# Altium project PICO核心板.PrjPcb
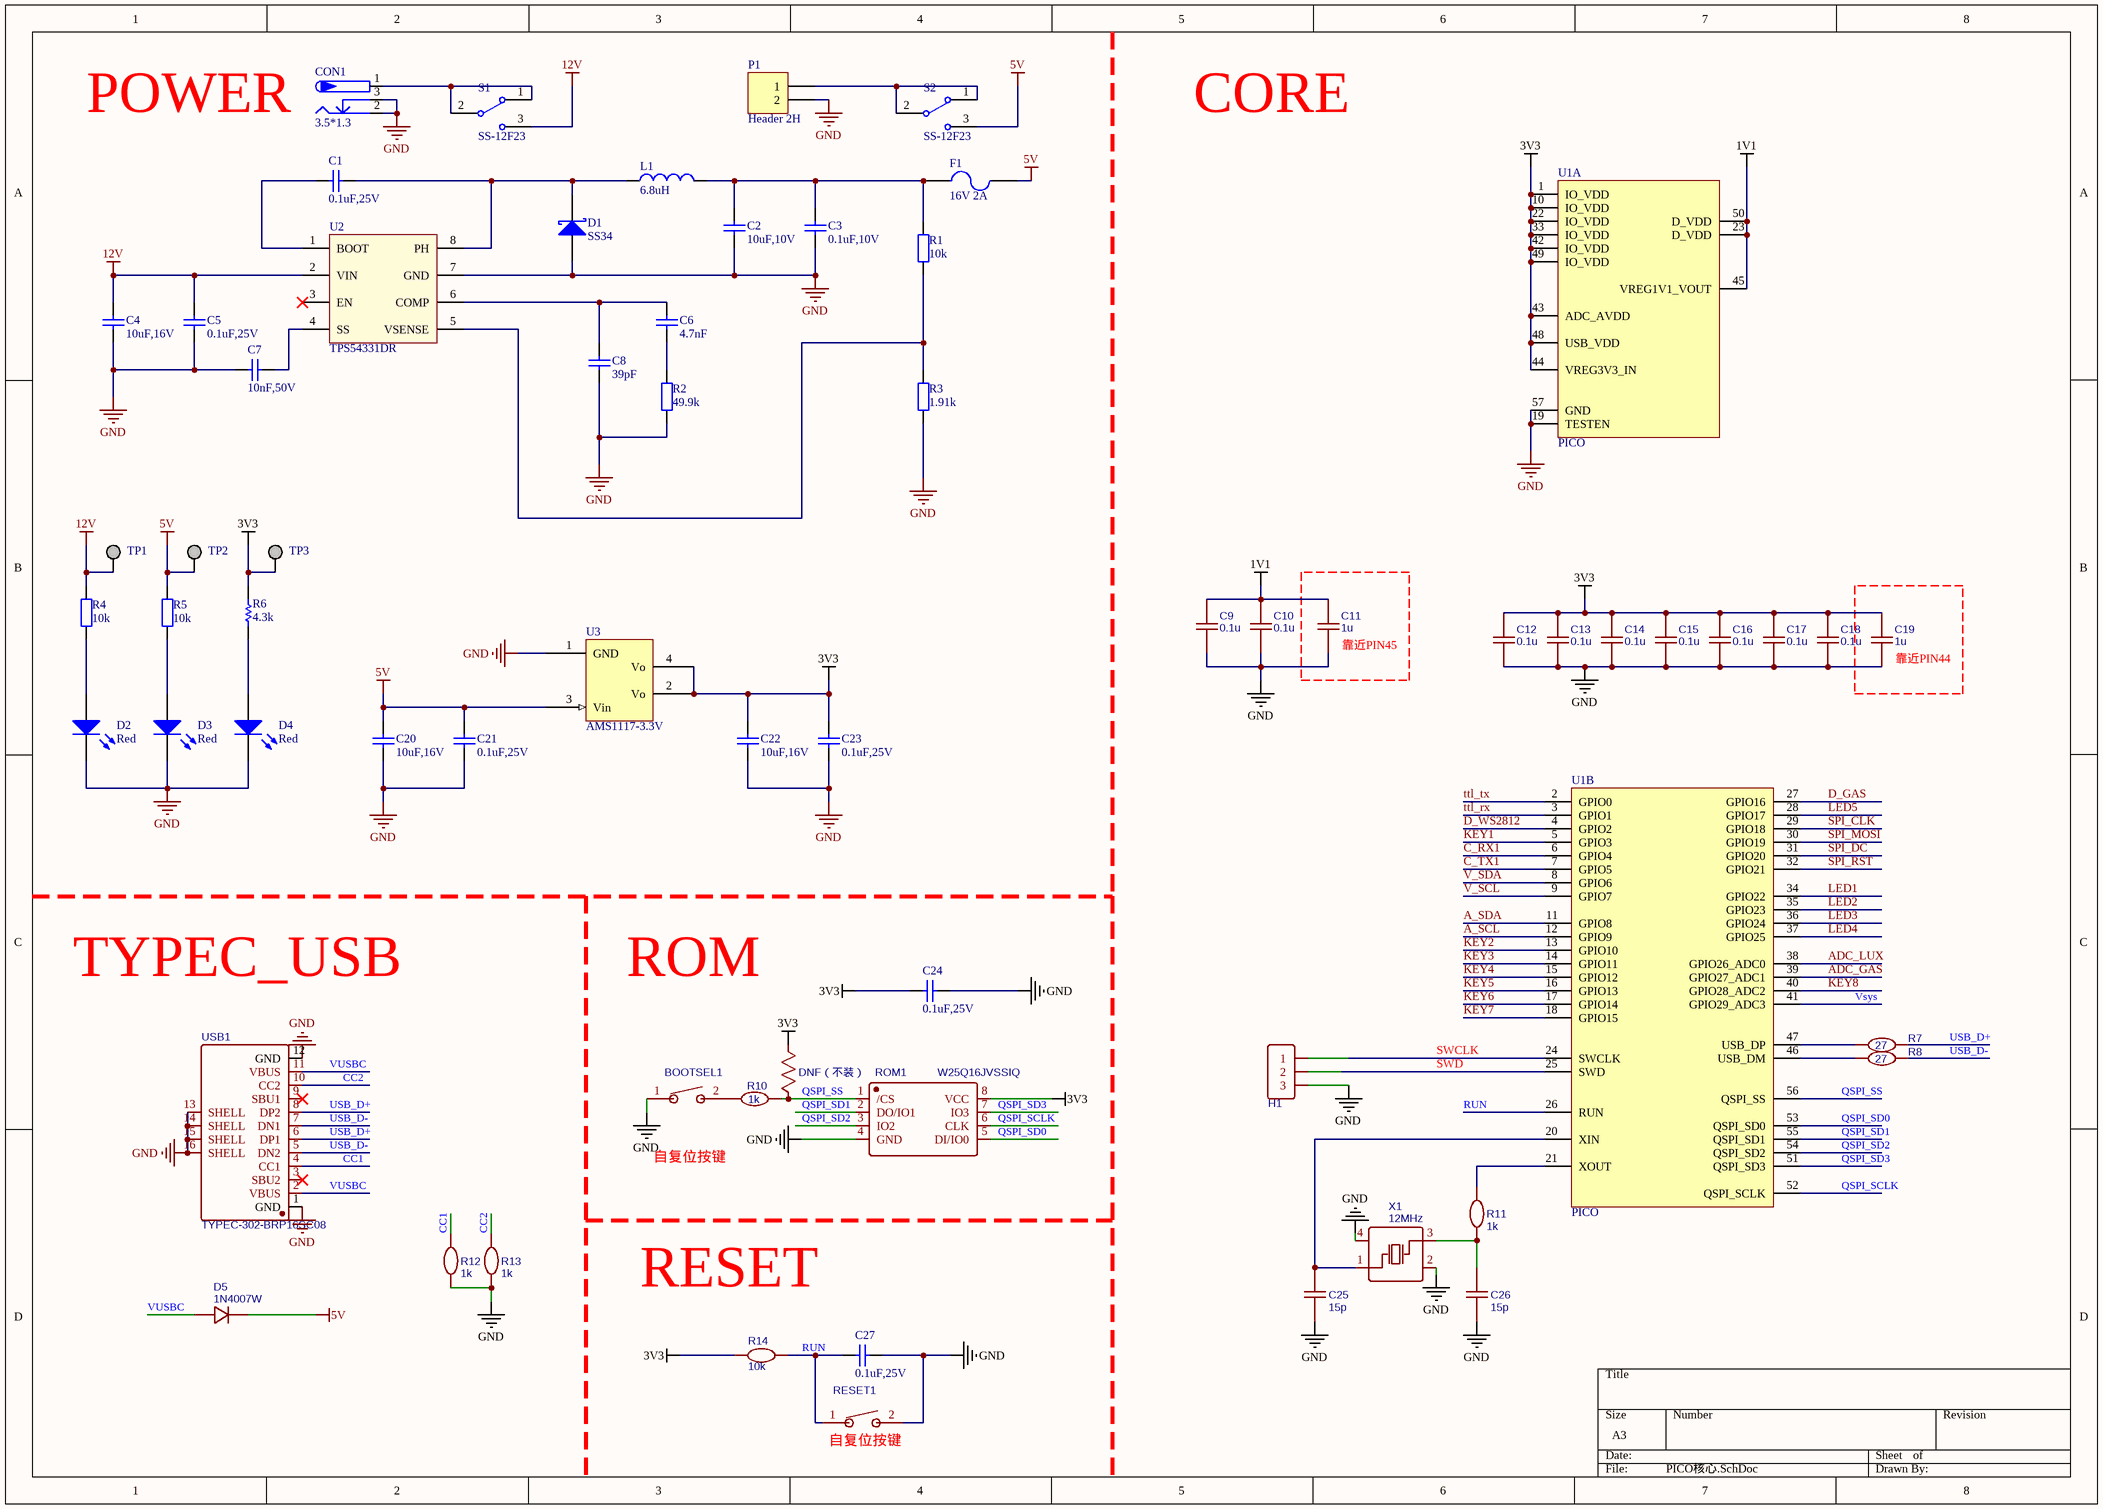
[diagram p0: PICO核心.SchDoc]
5 sheets, 147 parts. Net scope: global (net labels, ports and power ports of the same name join across sheets).
Board file: PICO核心.PcbDoc
Sheets:
  PICO核心.SchDoc
  传感器.SchDoc
  车门车灯子系统.SchDoc
  环境监测系统.SchDoc
  语音识别系统.SchDoc

## Sheet PICO核心.SchDoc
size A3

### Parts
BOOTSEL1  TSA343G00-250J2  [SW-SMD_4P-L6.2-W6.3-P4.00-LS9.4]  (value not drawn)
C1  value 0.1uF,25V  [0402_C]  (hidden comment: Cap)
C2  value 10uF,10V  [0402_C]  (hidden comment: Cap)
C3  value 0.1uF,10V  [1206_C]  (hidden comment: Cap)
C4  value 10uF,16V  [0402_C]  (hidden comment: Cap)
C5  value 0.1uF,25V  [0402_C]  (hidden comment: Cap)
C6  4.7nF  [0402_C]
C7  value 10nF,50V  [0402_C]  (hidden comment: Cap)
C8  39pF  [0402_C]
C9  0.1u  [0402_C]
C10  0.1u  [0402_C]
C11  1u  [0402_C]
C12  0.1u  [0402_C]
C13  0.1u  [0402_C]
C14  0.1u  [0402_C]
C15  0.1u  [0402_C]
C16  0.1u  [0402_C]
C17  0.1u  [0402_C]
C18  0.1u  [0402_C]
C19  1u  [0402_C]
C20  value 10uF,16V  [0402_C]  (hidden comment: Cap)
C21  value 0.1uF,25V  [0402_C]  (hidden comment: Cap)
C22  value 10uF,16V  [0402_C]  (hidden comment: Cap)
C23  value 0.1uF,25V  [0402_C]  (hidden comment: Cap)
C24  value 0.1uF,25V  [0402_C]  (hidden comment: Cap)
C25  15p  [0402_C]
C26  15p  [0402_C]
C27  value 0.1uF,25V  [0402_C]  (hidden comment: Cap)
CON1  3.5*1.3  [DC-IN-TH_DC-005-5A-2.5]
D1  value SS34  [SMA_L4.3-W2.6-LS5.2-RD]  (hidden comment: Diode Schottky)
D2  value Red  [0603_LED]  (hidden comment: LED)
D3  value Red  [0603_LED]  (hidden comment: LED)
D4  value Red  [0603_LED]  (hidden comment: LED)
D5  1N4007W  [SMA_L4.3-W2.6-LS5.2-RD]
F1  16V 2A  [1206_FUSE]
H1  HDR-F-2.54_1x3  [XH2.54A-3]  (value not drawn)
L1  6.8uH  [IND-SMD_L5.8-W5.2]
P1  Header 2H  [XH2.54A-2]
R1  value 10k  [0402_R]  (hidden comment: Res)
R2  49.9k  [0402_R]
R3  1.91k  [0402_R]
R4  value 10k  [0402_R]  (hidden comment: Res)
R5  value 10k  [0402_R]  (hidden comment: Res)
R6  value 4.3k  [0402_R]  (hidden comment: Res_5%)
R7  27  [0402_R]
R8  27  [0402_R]
R9  DNF（不装）  [0402_R]
R10  1k  [0402_R]
R11  1k  [0402_R]
R12  1k  [0402_R]
R13  1k  [0402_R]
R14  10k  [0402_R]
RESET1  TSA343G00-250J2  [SW-SMD_4P-L6.2-W6.3-P4.00-LS9.4]  (value not drawn)
ROM1  W25Q16JVSSIQ  [SOIC8-208mil]
S1  SS-12F23  [SW-TH_MT-0-103-A101-M200-RS]
S2  SS-12F23  [SW-TH_MT-0-103-A101-M200-RS]
TP1  TP  [TP_H]  (value not drawn)  (no BOM)
TP2  TP  [TP_H]  (value not drawn)  (no BOM)
TP3  TP  [TP_H]  (value not drawn)  (no BOM)
U1  PICO  [LQFN-56_L7.0-W7.0-P0.4-EP]  (parts A,B of 2)
U2  TPS54331DR  [SOIC8E]
U3  value AMS1117-3.3V  [SOT223]  (hidden comment: AMS1117)
USB1  TYPEC-302-BRP16SC08  [USB-C-SMD_TYPEC-302-BRP16SC08]
X1  12MHz  [OSC 3225-4P]

### Blocks framed on the sheet
靠近PIN45: C11
靠近PIN44: C19

### Nets
1V1: C9.1 C10.1 C11.2 U1.23(D_VDD) U1.45(VREG1V1_VOUT) U1.50(D_VDD)
3V3: C12.1 C13.2 C14.2 C15.2 C16.2 C17.2 C18.2 C19.2 C22.2 C23.2 C24.2 R6.2 R9.2 R14.2 ROM1.8(VCC) TP3.1 U1.1(IO_VDD) U1.10(IO_VDD) U1.22(IO_VDD) U1.33(IO_VDD) U1.42(IO_VDD) U1.43(ADC_AVDD) U1.44(VREG3V3_IN) U1.48(USB_VDD) U1.49(IO_VDD) U3.2(Vo) U3.4(Vo)
5V: C20.2 C21.2 D5.1 F1.2 R5.2 S2.3 TP2.1 U3.3(Vin)
12V: C4.2 C5.2 R4.2 S1.3 TP1.1 U2.2(VIN)
GND: BOOTSEL1.1 C2.1 C3.1 C4.1 C5.1 C7.2 C8.1 C9.2 C10.2 C11.1 C12.2 C13.1 C14.1 C15.1 C16.1 C17.1 C18.1 C19.1 C20.1 C21.1 C22.1 C23.1 C24.1 C25.1 C26.1 C27.2 CON1.2 CON1.3 D1.1(A) D2.2(K) D3.2(K) D4.2(K) H1.3 P1.2 R2.1 R3.1 R12.1 R13.1 RESET1.2 ROM1.4(GND) U1.19(TESTEN) U1.57(GND) U2.7(GND) U3.1(GND) USB1.1(GND) USB1.12(GND) USB1.13(SHELL) USB1.14(SHELL) USB1.15(SHELL) USB1.16(SHELL) X1.2(GND) X1.4(GND)
A_SCL: U1.12(GPIO9)
A_SDA: U1.11(GPIO8)
ADC_GAS: U1.39(GPIO27_ADC1)
ADC_LUX: U1.38(GPIO26_ADC0)
C_RX1: U1.6(GPIO4)
C_TX1: U1.7(GPIO5)
CC1: R12.2 USB1.4(CC1)
CC2: R13.2 USB1.10(CC2)
D_GAS: U1.27(GPIO16)
D_WS2812: U1.4(GPIO2)
KEY1: U1.5(GPIO3)
KEY2: U1.13(GPIO10)
KEY3: U1.14(GPIO11)
KEY4: U1.15(GPIO12)
KEY5: U1.16(GPIO13)
KEY6: U1.17(GPIO14)
KEY7: U1.18(GPIO15)
KEY8: U1.40(GPIO28_ADC2)
LED1: U1.34(GPIO22)
LED2: U1.35(GPIO23)
LED3: U1.36(GPIO24)
LED4: U1.37(GPIO25)
LED5: U1.28(GPIO17)
QSPI_SCLK: ROM1.6(CLK) U1.52(QSPI_SCLK)
QSPI_SD0: ROM1.5(DI/IO0) U1.53(QSPI_SD0)
QSPI_SD1: ROM1.2(DO/IO1) U1.55(QSPI_SD1)
QSPI_SD2: ROM1.3(IO2) U1.54(QSPI_SD2)
QSPI_SD3: ROM1.7(IO3) U1.51(QSPI_SD3)
QSPI_SS: R9.1 R10.2 ROM1.1(/CS) U1.56(QSPI_SS)
RUN: C27.1 R14.1 RESET1.1 U1.26(RUN)
SPI_CLK: U1.29(GPIO18)
SPI_DC: U1.31(GPIO20)
SPI_MOSI: U1.30(GPIO19)
SPI_RST: U1.32(GPIO21)
ttl_rx: U1.3(GPIO1)
ttl_tx: U1.2(GPIO0)
USB_D+: R7.2 USB1.6(DP1) USB1.8(DP2)
USB_D-: R8.2 USB1.5(DN2) USB1.7(DN1)
V_SCL: U1.9(GPIO7)
V_SDA: U1.8(GPIO6)
Vsys: U1.41(GPIO29_ADC3)
VUSBC: D5.2 USB1.2(VBUS) USB1.11(VBUS)
NetBOOTSEL1_2: BOOTSEL1.2 R10.1
NetC1_1: C1.1 D1.2(K) L1.1 U2.8(PH)
NetC1_2: C1.2 U2.1(BOOT)
NetC2_2: C2.2 C3.2 F1.1 L1.2 R1.2
NetC6_1: C6.1 R2.2
NetC6_2: C6.2 C8.2 U2.6(COMP)
NetC7_1: C7.1 U2.4(SS)
NetC25_2: C25.2 U1.20(XIN) X1.1(OSC1)
NetC26_2: C26.2 R11.1 X1.3(OSC2)
NetCON1_1: CON1.1 S1.1 S1.2
NetD2_1: D2.1(A) R4.1
NetD3_1: D3.1(A) R5.1
NetD4_1: D4.1(A) R6.1
NetH1_1: H1.1 U1.24(SWCLK)
NetH1_2: H1.2 U1.25(SWD)
NetP1_1: P1.1 S2.1 S2.2
NetR1_1: R1.1 R3.2 U2.5(VSENSE)
NetR7_1: R7.1 U1.47(USB_DP)
NetR8_1: R8.1 U1.46(USB_DM)
NetR11_2: R11.2 U1.21(XOUT)

Not connected (* = marked no-connect by the designer): U2 3(EN)*; USB1 3(SBU2)* 9(SBU1)*

### Notes on the sheet
- POWER
- CORE
- TYPEC_USB
- ROM
- SWCLK
- SWD
- 自复位按键
- RESET
- (near RESET1) 自复位按键

### Library data of the parts
BOOTSEL1 RESET1 = TSA343G00-250J2: BOM_Manufacturer: BRIGHT; Contributor: LCSC; BOM_Supplier: LCSC; BOM_Supplier Part: C354946; BOM_Manufacturer Part: TSA343G00-250J2; BOM_JLCPCB Part Class: Extended Part; spicePre: S; spiceSymbolName: TSA343G00-250J2
C1 C5 C21 C23 C24 C27 = T_Cap_0603_0.1uF_25V_X5R: 贴片电容; Part Typer: X5R; Solder: SMD; Withstand Voltage: 25V; Tolerance: 10%; Schematic Path: X:\Database\Schematic Library.Schlib; Part Number: T_Cap_0603_0.1uF_25V_X5R; LibRef: T_Cap_0603_0.1uF_25V_X5R
C2 C3 = T_Cap_1206_47uF_10V_X5R: 贴片电容; Part Typer: X5R; Solder: SMD; Withstand Voltage: 10V; Tolerance: 10%; Schematic Path: X:\Database\Schematic Library.Schlib; Part Number: T_Cap_1206_47uF_10V_X5R; LibRef: T_Cap_1206_47uF_10V_X5R
C4 C20 C22 = T_Cap_0603_10uF_16V_X5R: 贴片电容; Part Typer: X5R; Solder: SMD; Withstand Voltage: 16V; Tolerance: 10%; Schematic Path: X:\Database\Schematic Library.Schlib; Part Number: T_Cap_0603_10uF_16V_X5R; LibRef: T_Cap_0603_10uF_16V_X5R
C6 C8 = Cap
C7 = T_Cap_0603_10nF_50V_X7R: 贴片电容; Part Typer: X7R; Solder: SMD; Withstand Voltage: 50V; Tolerance: 10%; Schematic Path: X:\Database\Schematic Library.Schlib; Part Number: T_Cap_0603_10nF_50V_X7R; LibRef: T_Cap_0603_10nF_50V_X7R
C9-C19 = 0.1u: nameAlias: Value(F); Contributor: LCEDA_Lib; spicePre: C; spiceSymbolName: C_0603_US
C25 = 15p: nameAlias: Value(F); Contributor: LCEDA_Lib; spicePre: C; spiceSymbolName: C_0603_US
C26 = 15p: nameAlias: Value(F); Contributor: LCEDA_Lib; Package Display: No; spicePre: C; spiceSymbolName: C_0603_US
CON1 = P-DC: 低压电源接口; BOM名称: DC电源接口; 版权归属: 源创客; 学习资源: www.ooocke.com
D1 = T_SS34: 肖特基二极管; Part Number: T_SS34; Solder: SMD; Schematic Path: X:\Database\Schematic Library.Schlib; LibRef: T_SS34
D2-D4 = T_LED_Red_0805: 红色LED灯; Solder: SMD; Schematic Path: X:\Database\Schematic Library.Schlib; Part Number: T_LED_Red_0805; LibRef: T_LED_Red_0805
D5 = 1N4007W: BOM_Manufacturer: BLUE ROCKET; Contributor: LCEDA_Lib; BOM_Supplier: LCSC; BOM_Supplier Part: C328592; BOM_Manufacturer Part: 1N4007W; spicePre: D; spiceSymbolName: 1N4007W
F1 = Fuse
H1 = HDR-F-2.54_1x3: Contributor: LCEDA_Lib; BOM_Supplier Part: C146690; BOM_Supplier: LCSC; spicePre: H; spiceSymbolName: HDR-F-2.54_1x3
L1 = Inductor
P1 = Header 2H: Header, 2-Pin, Right Angle; LatestRevisionDate: 17-Jul-2002; LatestRevisionNote: Re-released for DXP Platform.; Publisher: Altium Limited
R1 R4 R5 = T_Res_0603_10k_1%_1/10W: 贴片电阻; Solder: SMD; Power: 1/10W; Tolerance: 1%; Schematic Path: X:\Database\Schematic Library.Schlib; Part Number: T_Res_0603_10k_1%_1/10W; LibRef: T_Res_0603_10k_1%_1/10W
R2 R3 = Res
R6 = T_Res_0603_4.3k_5%_1/10W: 贴片电阻; Solder: SMD; Power: 1/10W; Tolerance: 5%; Schematic Path: X:\Database\Schematic Library.Schlib; Part Number: T_Res_0603_4.3k_5%_1/10W; LibRef: T_Res_0603_4.3k_5%_1/10W
R7 R8 = 27: nameAlias: Value(Ω); Contributor: LCEDA_Lib; spicePre: R; spiceSymbolName: R_0603_EU
R9 = DNF（不装）: nameAlias: Value(Ω); Contributor: LCEDA_Lib; spicePre: R; spiceSymbolName: R_0603_US
R10-R14 = 1k: nameAlias: Value(Ω); Contributor: LCEDA_Lib; spicePre: R; spiceSymbolName: R_0603_EU
ROM1 = W25Q16JVSSIQ: BOM_Manufacturer: WINBOND; BOM_Supplier: LCSC; BOM_Manufacturer Part: W25Q16JVSSIQ; BOM_Supplier Part: C82317; BOM_JLCPCB Part Class: Extended Part; spicePre: U; spiceSymbolName: W25Q16JVSSIQ
S1 S2 = SSW-1P: 1路波动开关; BOM名称: 波动开关; 版权归属: 源创客; 学习资源: www.ooocke.com
TP1-TP3 = T_TestPoint_H: 测试点_过孔; Solder: DIP; Schematic Path: X:\Database\Schematic Library.Schlib; Part Number: T_TestPoint_H; LibRef: T_TestPoint_H
U1 = PICO_CORE
U2 = TPS54331: TI, 3A, 3.5-28V, Buck
U3 = T_AMS1117-3.3V: 电源芯片; Solder: SMD; Schematic Path: X:\Database\Schematic Library.Schlib; Part Number: T_AMS1117-3.3V; LibRef: T_AMS1117-3.3V; ComponentLink2Description: Datasheet; ComponentLink2URL: X:\Database\Datasheet\AMS1117.pdf
USB1 = TYPEC-302-BRP16SC08: BOM_Manufacturer: XUNPU(讯普); Contributor: LCSC; BOM_Supplier: LCSC; BOM_Supplier Part: C2835312; BOM_Manufacturer Part: TYPEC-302-BRP16SC08; spicePre: U; spiceSymbolName: TYPEC-302-BRP16SC08
X1 = 12MHz: BOM_Manufacturer: YXC; BOM_Manufacturer Part: X322512MLB4SI; nameAlias: Frequency; BOM_Supplier: LCSC; BOM_Supplier Part: C112971; BOM_JLCPCB Part Class: Extended Part; spicePre: X; spiceSymbolName: X322512MLB4SI

## Sheet 传感器.SchDoc
size A4
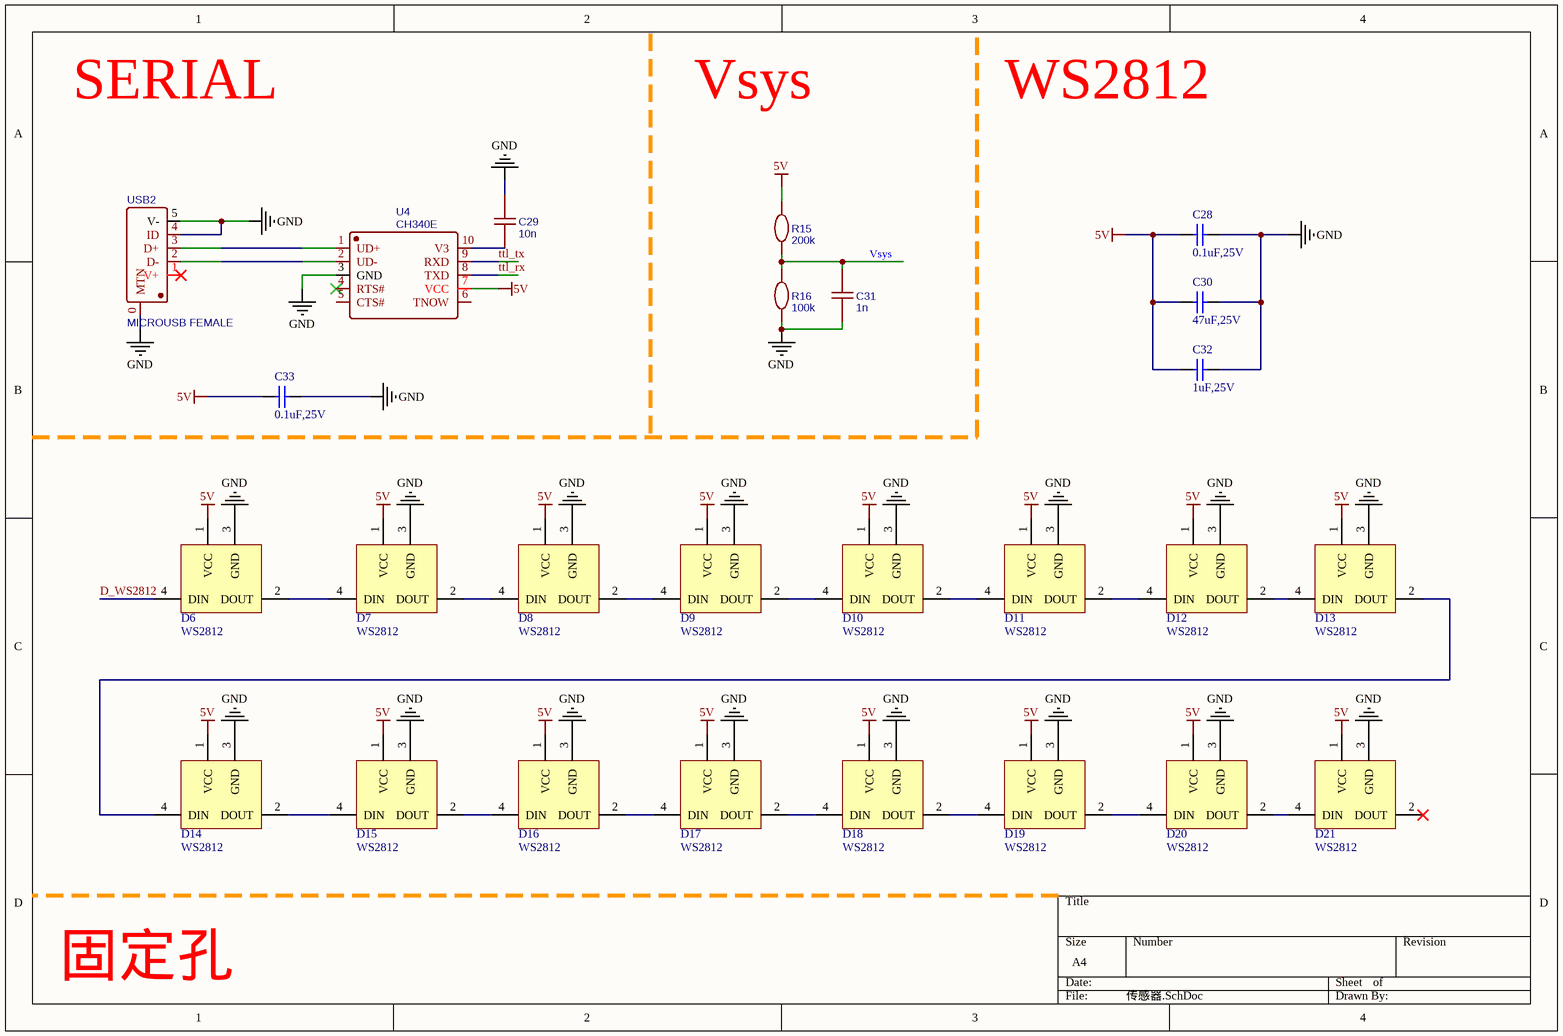
[diagram p1: 传感器.SchDoc]

### Parts
C28  value 0.1uF,25V  [0402_C]  (hidden comment: Cap)
C29  10n  [0402_C]
C30  value 47uF,25V  [0402_C]  (hidden comment: Cap)
C31  1n  [0402_C]
C32  value 1uF,25V  [0402_C]  (hidden comment: Cap)
C33  value 0.1uF,25V  [0402_C]  (hidden comment: Cap)
D6  WS2812  [LED-SMD_4P-L3.5-W3.5-TL_WS2812B]
D7  WS2812  [LED-SMD_4P-L3.5-W3.5-TL_WS2812B]
D8  WS2812  [LED-SMD_4P-L3.5-W3.5-TL_WS2812B]
D9  WS2812  [LED-SMD_4P-L3.5-W3.5-TL_WS2812B]
D10  WS2812  [LED-SMD_4P-L3.5-W3.5-TL_WS2812B]
D11  WS2812  [LED-SMD_4P-L3.5-W3.5-TL_WS2812B]
D12  WS2812  [LED-SMD_4P-L3.5-W3.5-TL_WS2812B]
D13  WS2812  [LED-SMD_4P-L3.5-W3.5-TL_WS2812B]
D14  WS2812  [LED-SMD_4P-L3.5-W3.5-TL_WS2812B]
D15  WS2812  [LED-SMD_4P-L3.5-W3.5-TL_WS2812B]
D16  WS2812  [LED-SMD_4P-L3.5-W3.5-TL_WS2812B]
D17  WS2812  [LED-SMD_4P-L3.5-W3.5-TL_WS2812B]
D18  WS2812  [LED-SMD_4P-L3.5-W3.5-TL_WS2812B]
D19  WS2812  [LED-SMD_4P-L3.5-W3.5-TL_WS2812B]
D20  WS2812  [LED-SMD_4P-L3.5-W3.5-TL_WS2812B]
D21  WS2812  [LED-SMD_4P-L3.5-W3.5-TL_WS2812B]
R15  200k  [0402_R]
R16  100k  [0402_R]
U4  CH340E  [MSOP-10_L3.0-W3.0-P0.50-LS5.0-BL]
USB2  MICROUSB FEMALE  [USB-B/S_A]

### Nets
5V: C28.2 C30.2 C32.2 C33.2 D6.1(VCC) D7.1(VCC) D8.1(VCC) D9.1(VCC) D10.1(VCC) D11.1(VCC) D12.1(VCC) D13.1(VCC) D14.1(VCC) D15.1(VCC) D16.1(VCC) D17.1(VCC) D18.1(VCC) D19.1(VCC) D20.1(VCC) D21.1(VCC) R15.2 U4.7(VCC)
GND: C28.1 C29.2 C30.1 C31.1 C32.1 C33.1 D6.3(GND) D7.3(GND) D8.3(GND) D9.3(GND) D10.3(GND) D11.3(GND) D12.3(GND) D13.3(GND) D14.3(GND) D15.3(GND) D16.3(GND) D17.3(GND) D18.3(GND) D19.3(GND) D20.3(GND) D21.3(GND) R16.1 U4.3(GND) USB2.0(MTN) USB2.4(ID) USB2.5(V-)
D_WS2812: D6.4(DIN)
ttl_rx: U4.8(TXD)
ttl_tx: U4.9(RXD)
Vsys: C31.2 R15.1 R16.2
NetC29_1: C29.1 U4.10(V3)
NetD6_2: D6.2(DOUT) D7.4(DIN)
NetD7_2: D7.2(DOUT) D8.4(DIN)
NetD8_2: D8.2(DOUT) D9.4(DIN)
NetD9_2: D9.2(DOUT) D10.4(DIN)
NetD10_2: D10.2(DOUT) D11.4(DIN)
NetD11_2: D11.2(DOUT) D12.4(DIN)
NetD12_2: D12.2(DOUT) D13.4(DIN)
NetD13_2: D13.2(DOUT) D14.4(DIN)
NetD14_2: D14.2(DOUT) D15.4(DIN)
NetD15_2: D15.2(DOUT) D16.4(DIN)
NetD16_2: D16.2(DOUT) D17.4(DIN)
NetD17_2: D17.2(DOUT) D18.4(DIN)
NetD18_2: D18.2(DOUT) D19.4(DIN)
NetD19_2: D19.2(DOUT) D20.4(DIN)
NetD20_2: D20.2(DOUT) D21.4(DIN)
NetU4_1: U4.1(UD+) USB2.3(D+)
NetU4_2: U4.2(UD-) USB2.2(D-)

Not connected (* = marked no-connect by the designer): D21 2(DOUT)*; U4 4(RTS#)* 5(CTS#) 6(TNOW); USB2 1(V+)*

### Notes on the sheet
- SERIAL
- Vsys
- WS2812
- 固定孔

### Library data of the parts
C28 C30 C32 C33 = T_Cap_0603_0.1uF_25V_X5R: as C1 on sheet PICO核心; Part Number: T_Cap_0603_0.1uF_25V_X5R; LibRef: T_Cap_0603_0.1uF_25V_X5R
C29 = 10n: nameAlias: Value(F); Contributor: LCEDA_Lib; spicePre: C; spiceSymbolName: C_0603_US
C31 = 1n: nameAlias: Value(F); Contributor: LCEDA_Lib; spicePre: C; spiceSymbolName: C_0603_US
R15 = 200k: nameAlias: Value(Ω); Contributor: LCEDA_Lib; spicePre: R; spiceSymbolName: R_0603_EU
R16 = 100k: nameAlias: Value(Ω); Contributor: LCEDA_Lib; spicePre: R; spiceSymbolName: R_0603_EU
U4 = CH340E: BOM_Manufacturer: WCH; BOM_Supplier: LCSC; BOM_Manufacturer Part: CH340E; BOM_Supplier Part: C99652; BOM_JLCPCB Part Class: Extended Part; spicePre: U; spiceSymbolName: CH340E
USB2 = MICROUSB FEMALE: BOM_Manufacturer: ValuePro; BOM_Supplier: LCSC; BOM_Manufacturer Part: micro USBFemale; BOM_Supplier Part: C10418; BOM_JLCPCB Part Class: Extended Part; spicePre: U; spiceSymbolName: MICROUSB FEMALE

## Sheet 车门车灯子系统.SchDoc
size A4
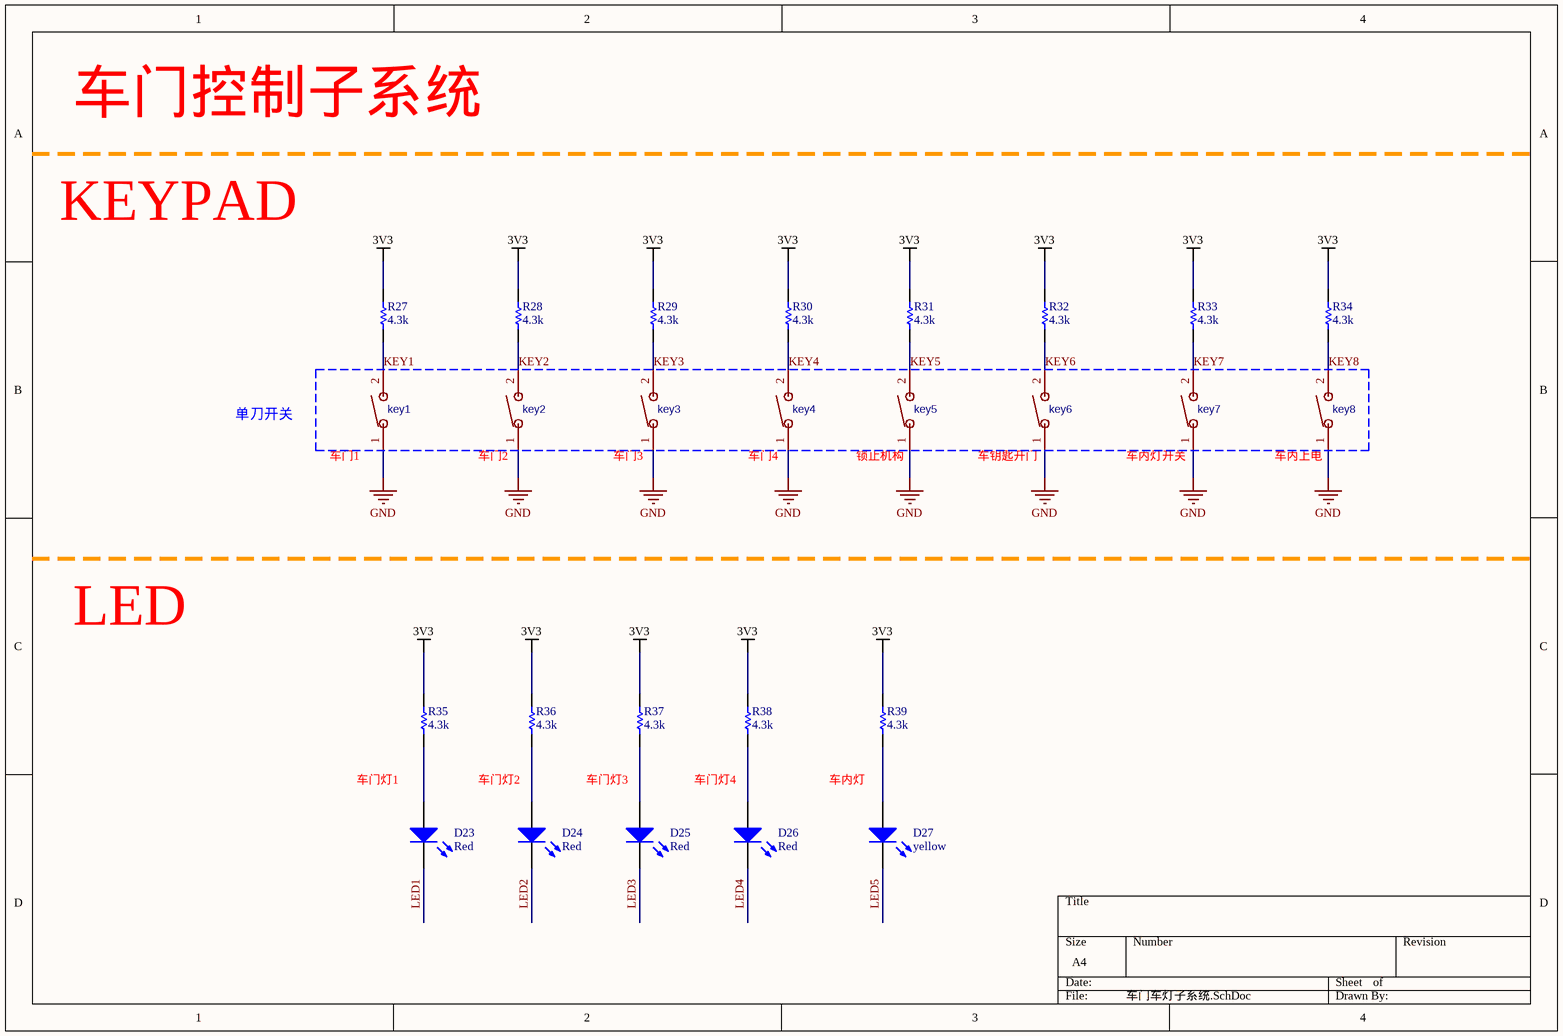
[diagram p2: 车门车灯子系统.SchDoc]

### Parts
D23  value Red  [LED-TH_L5.0-W2.7-FD]  (hidden comment: LED)
D24  value Red  [LED-TH_L5.0-W2.7-FD]  (hidden comment: LED)
D25  value Red  [LED-TH_L5.0-W2.7-FD]  (hidden comment: LED)
D26  value Red  [LED-TH_L5.0-W2.7-FD]  (hidden comment: LED)
D27  value yellow  [LED-TH_L5.0-W2.7-FD]  (hidden comment: LED)
key1  TSA343G00-250J2  [SW-TH_DEALON_MS-12D19-G2]  (value not drawn)
key2  TSA343G00-250J2  [SW-TH_DEALON_MS-12D19-G2]  (value not drawn)
key3  TSA343G00-250J2  [SW-TH_DEALON_MS-12D19-G2]  (value not drawn)
key4  TSA343G00-250J2  [SW-TH_DEALON_MS-12D19-G2]  (value not drawn)
key5  TSA343G00-250J2  [SW-TH_DEALON_MS-12D19-G2]  (value not drawn)
key6  TSA343G00-250J2  [SW-TH_DEALON_MS-12D19-G2]  (value not drawn)
key7  TSA343G00-250J2  [SW-TH_DEALON_MS-12D19-G2]  (value not drawn)
key8  TSA343G00-250J2  [SW-TH_DEALON_MS-12D19-G2]  (value not drawn)
R27  value 4.3k  [0402_R]  (hidden comment: Res_5%)
R28  value 4.3k  [0402_R]  (hidden comment: Res_5%)
R29  value 4.3k  [0402_R]  (hidden comment: Res_5%)
R30  value 4.3k  [0402_R]  (hidden comment: Res_5%)
R31  value 4.3k  [0402_R]  (hidden comment: Res_5%)
R32  value 4.3k  [0402_R]  (hidden comment: Res_5%)
R33  value 4.3k  [0402_R]  (hidden comment: Res_5%)
R34  value 4.3k  [0402_R]  (hidden comment: Res_5%)
R35  value 4.3k  [0402_R]  (hidden comment: Res_5%)
R36  value 4.3k  [0402_R]  (hidden comment: Res_5%)
R37  value 4.3k  [0402_R]  (hidden comment: Res_5%)
R38  value 4.3k  [0402_R]  (hidden comment: Res_5%)
R39  value 4.3k  [0402_R]  (hidden comment: Res_5%)

### Nets
3V3: R27.2 R28.2 R29.2 R30.2 R31.2 R32.2 R33.2 R34.2 R35.2 R36.2 R37.2 R38.2 R39.2
GND: key1.1 key2.1 key3.1 key4.1 key5.1 key6.1 key7.1 key8.1
KEY1: key1.2 R27.1
KEY2: key2.2 R28.1
KEY3: key3.2 R29.1
KEY4: key4.2 R30.1
KEY5: key5.2 R31.1
KEY6: key6.2 R32.1
KEY7: key7.2 R33.1
KEY8: key8.2 R34.1
LED1: D23.2(K)
LED2: D24.2(K)
LED3: D25.2(K)
LED4: D26.2(K)
LED5: D27.2(K)
NetD23_1: D23.1(A) R35.1
NetD24_1: D24.1(A) R36.1
NetD25_1: D25.1(A) R37.1
NetD26_1: D26.1(A) R38.1
NetD27_1: D27.1(A) R39.1

### Notes on the sheet
- 车门控制子系统
- KEYPAD
- 单刀开关
- (near key1) 车门1
- (near key2) 车门2
- (near key3) 车门3
- (near key4) 车门4
- (near key5) 锁止机构
- 车钥匙开门
- (near key7) 车内灯开关
- (near key8) 车内上电
- LED
- 车门灯1
- 车门灯2
- 车门灯3
- 车门灯4
- 车内灯

### Library data of the parts
D23-D27 = T_LED_Red_0805: as D2 on sheet PICO核心; Part Number: T_LED_Red_0805; LibRef: T_LED_Red_0805
key1-key8 = TSA343G00-250J2: as BOOTSEL1 on sheet PICO核心; BOM_Supplier: LCSC; BOM_Supplier Part: C354946; BOM_Manufacturer Part: TSA343G00-250J2; BOM_JLCPCB Part Class: Extended Part; spicePre: S; spiceSymbolName: TSA343G00-250J2
R27-R39 = T_Res_0603_4.3k_5%_1/10W: as R6 on sheet PICO核心; Part Number: T_Res_0603_4.3k_5%_1/10W; LibRef: T_Res_0603_4.3k_5%_1/10W

## Sheet 环境监测系统.SchDoc
size A4
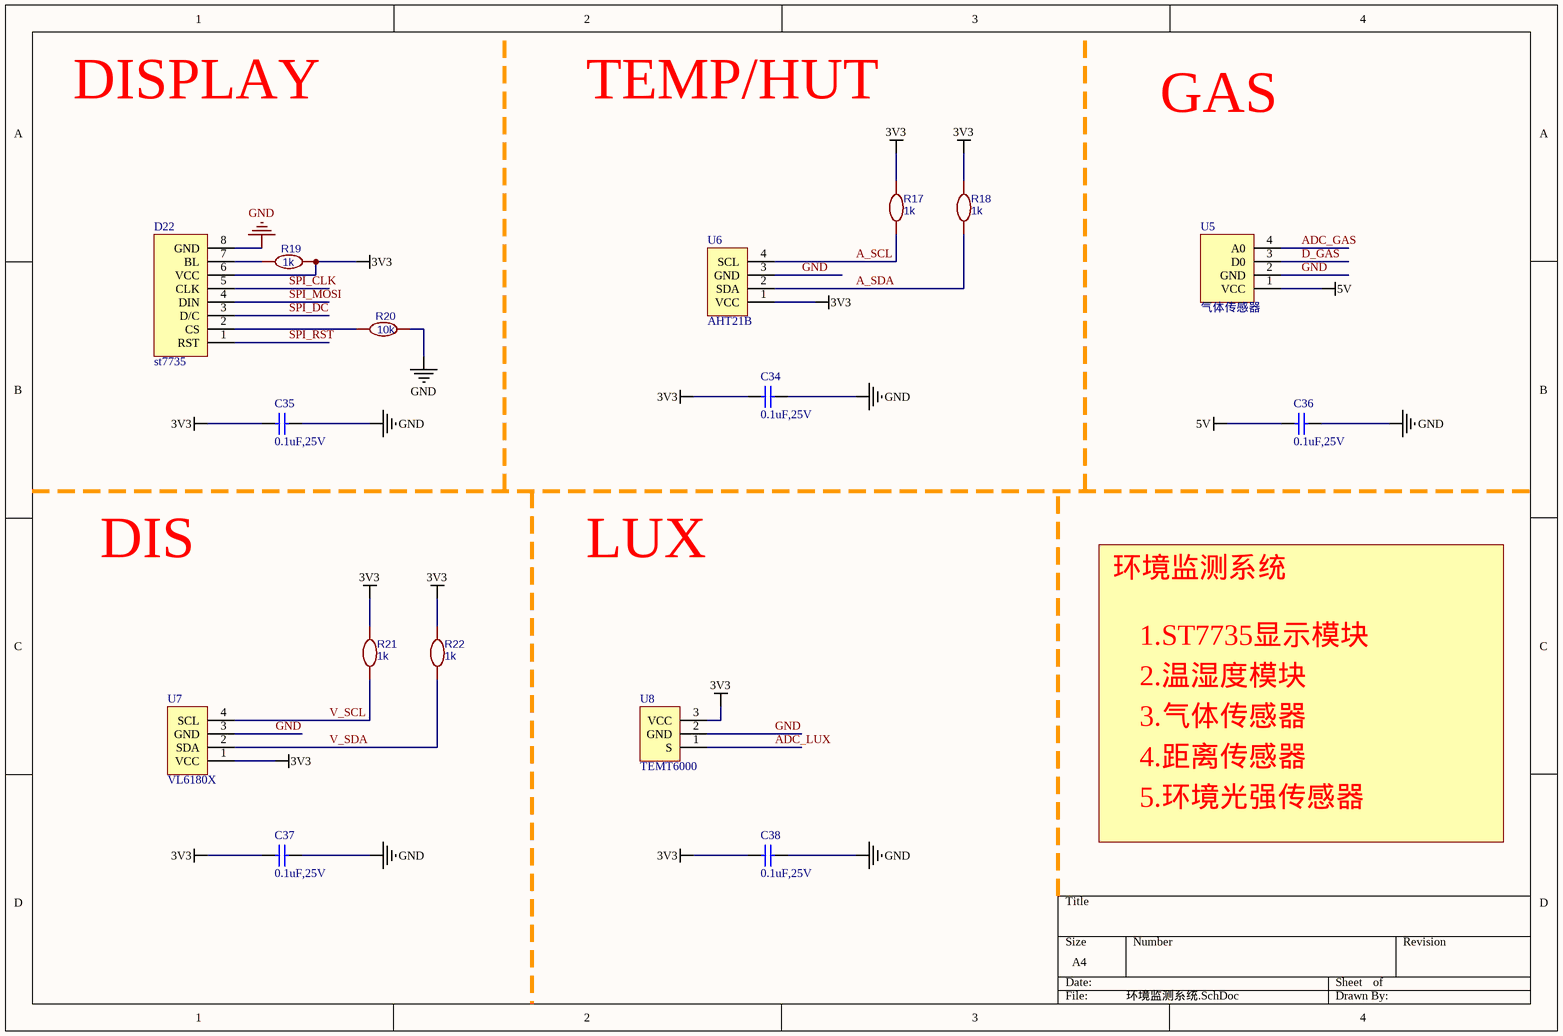
[diagram p3: 环境监测系统.SchDoc]

### Parts
C34  value 0.1uF,25V  [0402_C]  (hidden comment: Cap)
C35  value 0.1uF,25V  [0402_C]  (hidden comment: Cap)
C36  value 0.1uF,25V  [0402_C]  (hidden comment: Cap)
C37  value 0.1uF,25V  [0402_C]  (hidden comment: Cap)
C38  value 0.1uF,25V  [0402_C]  (hidden comment: Cap)
D22  st7735  [HDR1X8]
R17  1k  [0402_R]
R18  1k  [0402_R]
R19  1k  [0402_R]
R20  10k  [0402_R]
R21  1k  [0402_R]
R22  1k  [0402_R]
U5  气体传感器  [XH2.54A-4]
U6  AHT21B  [XH2.54A-4]
U7  VL6180X  [XH2.54A-4]
U8  TEMT6000  [XH2.54A-3]

### Nets
3V3: C34.2 C35.2 C37.2 C38.2 D22.6(VCC) R17.2 R18.2 R19.2 R21.2 R22.2 U6.1(VCC) U7.1(VCC) U8.3(VCC)
5V: C36.2 U5.1(VCC)
GND: C34.1 C35.1 C36.1 C37.1 C38.1 D22.8(GND) R20.2 U5.2(GND) U6.3(GND) U7.3(GND) U8.2(GND)
A_SCL: R17.1 U6.4(SCL)
A_SDA: R18.1 U6.2(SDA)
ADC_GAS: U5.4(A0)
ADC_LUX: U8.1(S)
D_GAS: U5.3(D0)
SPI_CLK: D22.5(CLK)
SPI_DC: D22.3(D/C)
SPI_MOSI: D22.4(DIN)
SPI_RST: D22.1(RST)
V_SCL: R21.1 U7.4(SCL)
V_SDA: R22.1 U7.2(SDA)
NetD22_2: D22.2(CS) R20.1
NetD22_7: D22.7(BL) R19.1

### Notes on the sheet
- DISPLAY
- TEMP/HUT
- GAS
- DIS
- LUX
- 环境监测系统
- 1.ST7735显示模块
- 2.温湿度模块
- 3.气体传感器
- 4.距离传感器
- 5.环境光强传感器

### Library data of the parts
C34-C38 = T_Cap_0603_0.1uF_25V_X5R: as C1 on sheet PICO核心; Part Number: T_Cap_0603_0.1uF_25V_X5R; LibRef: T_Cap_0603_0.1uF_25V_X5R
R17-R22 = 1k: as R10 on sheet PICO核心; spicePre: R; spiceSymbolName: R_0603_EU
U5 = MQ135

## Sheet 语音识别系统.SchDoc
size A4
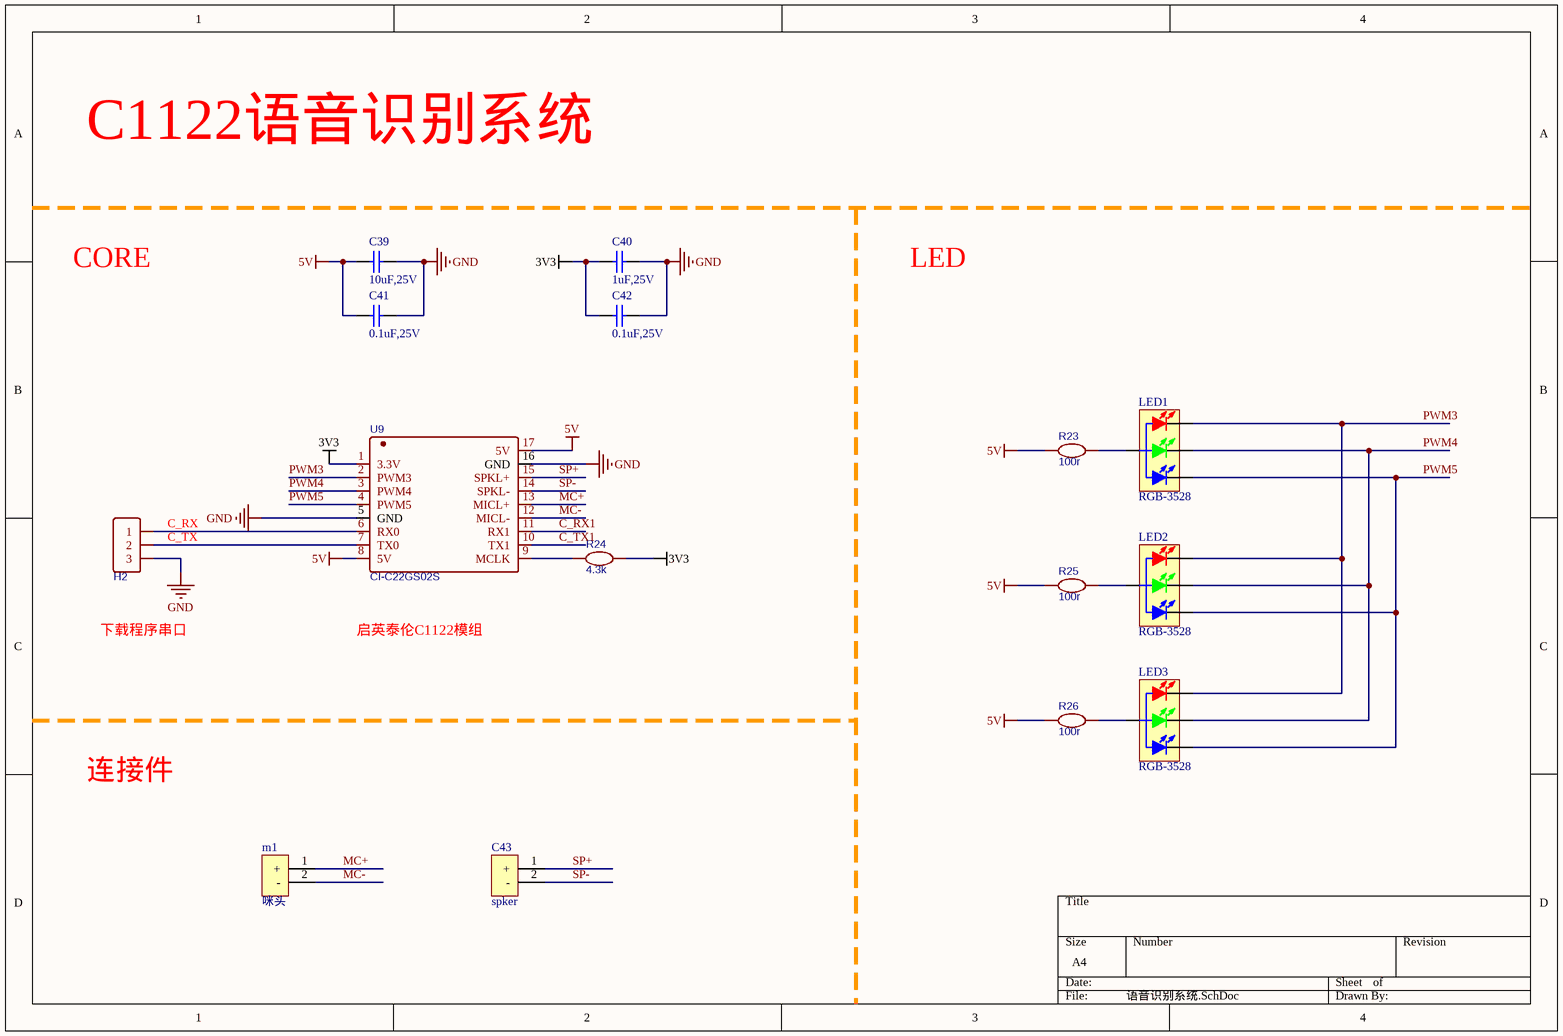
[diagram p4: 语音识别系统.SchDoc]

### Parts
C39  value 10uF,25V  [0402_C]  (hidden comment: Cap)
C40  value 1uF,25V  [0402_C]  (hidden comment: Cap)
C41  value 0.1uF,25V  [0402_C]  (hidden comment: Cap)
C42  value 0.1uF,25V  [0402_C]  (hidden comment: Cap)
C43  spker  [XH2.54A-2]
H2  HDR-F-2.54_1x3  [XH2.54A-3]  (value not drawn)
LED1  RGB-3528  [LED-TH_4P-BD6.9-P1.27-R]
LED2  RGB-3528  [LED-TH_4P-BD6.9-P1.27-R]
LED3  RGB-3528  [LED-TH_4P-BD6.9-P1.27-R]
m1  咪头  [MIC-TH_BD6.0-P1.90-D0.4-L-RD]
R23  100r  [0402_R]
R24  4.3k  [0402_R]
R25  100r  [0402_R]
R26  100r  [0402_R]
U9  CI-C22GS02S  [SMD-17_L20.0-W1.80-CI-C22GS02S]

### Nets
3V3: C40.1 C42.1 R24.1 U9.1(3.3V)
5V: C39.1 C41.1 R23.2 R25.2 R26.2 U9.8(5V) U9.17(5V)
GND: C39.2 C40.2 C41.2 C42.2 H2.3 U9.5(GND) U9.16(GND)
C_RX1: U9.11(RX1)
C_TX1: U9.10(TX1)
MC+: m1.1(+) U9.13(MICL+)
MC-: m1.2(-) U9.12(MICL-)
PWM3: LED1.1(RED_K) LED2.1(RED_K) LED3.1(RED_K) U9.2(PWM3)
PWM4: LED1.3(GREEN_K) LED2.3(GREEN_K) LED3.3(GREEN_K) U9.3(PWM4)
PWM5: LED1.4(BULE_K) LED2.4(BULE_K) LED3.4(BULE_K) U9.4(PWM5)
SP+: C43.1(+) U9.15(SPKL+)
SP-: C43.2(-) U9.14(SPKL-)
NetH2_1: H2.1 U9.6(RX0)
NetH2_2: H2.2 U9.7(TX0)
NetLED1_2: LED1.2(A) R23.1
NetLED2_2: LED2.2(A) R25.1
NetLED3_2: LED3.2(A) R26.1
NetR24_2: R24.2 U9.9(MCLK)

### Notes on the sheet
- C1122语音识别系统
- CORE
- LED
- (near H2) C_RX
- (near H2) C_TX
- 下载程序串口
- 启英泰伦C1122模组
- 连接件

### Library data of the parts
C39-C42 = T_Cap_0603_0.1uF_25V_X5R: as C1 on sheet PICO核心; Part Number: T_Cap_0603_0.1uF_25V_X5R; LibRef: T_Cap_0603_0.1uF_25V_X5R
C43 = SPK
H2 = HDR-F-2.54_1x3: Contributor: LCEDA_Lib; BOM_Supplier Part: C146690; BOM_Supplier: LCSC; spicePre: H; spiceSymbolName: HDR-F-2.54_1x3
LED1-LED3 = LED-RGB-3528: 三基色LED; 版权归属: 源创客; BOM名称: 三基色LED; 学习资源: www.ooocke.com
m1 = mic
R23-R26 = 100k: as R16 on sheet 传感器; spicePre: R; spiceSymbolName: R_0603_EU
U9 = CI-C22GS02S: BOM_Manufacturer: Chiplntelli(启英泰伦); Contributor: LCSC; BOM_Supplier: LCSC; BOM_Supplier Part: C2759836; BOM_Manufacturer Part: CI-C22GS02S; BOM_JLCPCB Part Class: Extended Part; spicePre: U; spiceSymbolName: CI-C22GS02S

## Nets that join several sheets
3V3: PICO核心 (27 pins), 车门车灯子系统 (13 pins), 环境监测系统 (13 pins), 语音识别系统 (C40.1 C42.1 R24.1 U9.1)
5V: PICO核心 (8 pins), 传感器 (22 pins), 环境监测系统 (C36.2 U5.1), 语音识别系统 (7 pins)
GND: PICO核心 (52 pins), 传感器 (27 pins), 车门车灯子系统 (8 pins), 环境监测系统 (11 pins), 语音识别系统 (7 pins)
A_SCL: PICO核心 (U1.12), 环境监测系统 (R17.1 U6.4)
A_SDA: PICO核心 (U1.11), 环境监测系统 (R18.1 U6.2)
ADC_GAS: PICO核心 (U1.39), 环境监测系统 (U5.4)
ADC_LUX: PICO核心 (U1.38), 环境监测系统 (U8.1)
C_RX1: PICO核心 (U1.6), 语音识别系统 (U9.11)
C_TX1: PICO核心 (U1.7), 语音识别系统 (U9.10)
D_GAS: PICO核心 (U1.27), 环境监测系统 (U5.3)
D_WS2812: PICO核心 (U1.4), 传感器 (D6.4)
KEY1: PICO核心 (U1.5), 车门车灯子系统 (key1.2 R27.1)
KEY2: PICO核心 (U1.13), 车门车灯子系统 (key2.2 R28.1)
KEY3: PICO核心 (U1.14), 车门车灯子系统 (key3.2 R29.1)
KEY4: PICO核心 (U1.15), 车门车灯子系统 (key4.2 R30.1)
KEY5: PICO核心 (U1.16), 车门车灯子系统 (key5.2 R31.1)
KEY6: PICO核心 (U1.17), 车门车灯子系统 (key6.2 R32.1)
KEY7: PICO核心 (U1.18), 车门车灯子系统 (key7.2 R33.1)
KEY8: PICO核心 (U1.40), 车门车灯子系统 (key8.2 R34.1)
LED1: PICO核心 (U1.34), 车门车灯子系统 (D23.2)
LED2: PICO核心 (U1.35), 车门车灯子系统 (D24.2)
LED3: PICO核心 (U1.36), 车门车灯子系统 (D25.2)
LED4: PICO核心 (U1.37), 车门车灯子系统 (D26.2)
LED5: PICO核心 (U1.28), 车门车灯子系统 (D27.2)
SPI_CLK: PICO核心 (U1.29), 环境监测系统 (D22.5)
SPI_DC: PICO核心 (U1.31), 环境监测系统 (D22.3)
SPI_MOSI: PICO核心 (U1.30), 环境监测系统 (D22.4)
SPI_RST: PICO核心 (U1.32), 环境监测系统 (D22.1)
ttl_rx: PICO核心 (U1.3), 传感器 (U4.8)
ttl_tx: PICO核心 (U1.2), 传感器 (U4.9)
V_SCL: PICO核心 (U1.9), 环境监测系统 (R21.1 U7.4)
V_SDA: PICO核心 (U1.8), 环境监测系统 (R22.1 U7.2)
Vsys: PICO核心 (U1.41), 传感器 (C31.2 R15.1 R16.2)